# Altium schematic sheet Main.SchDoc: Main
size Tabloid; Author: Parker Brown
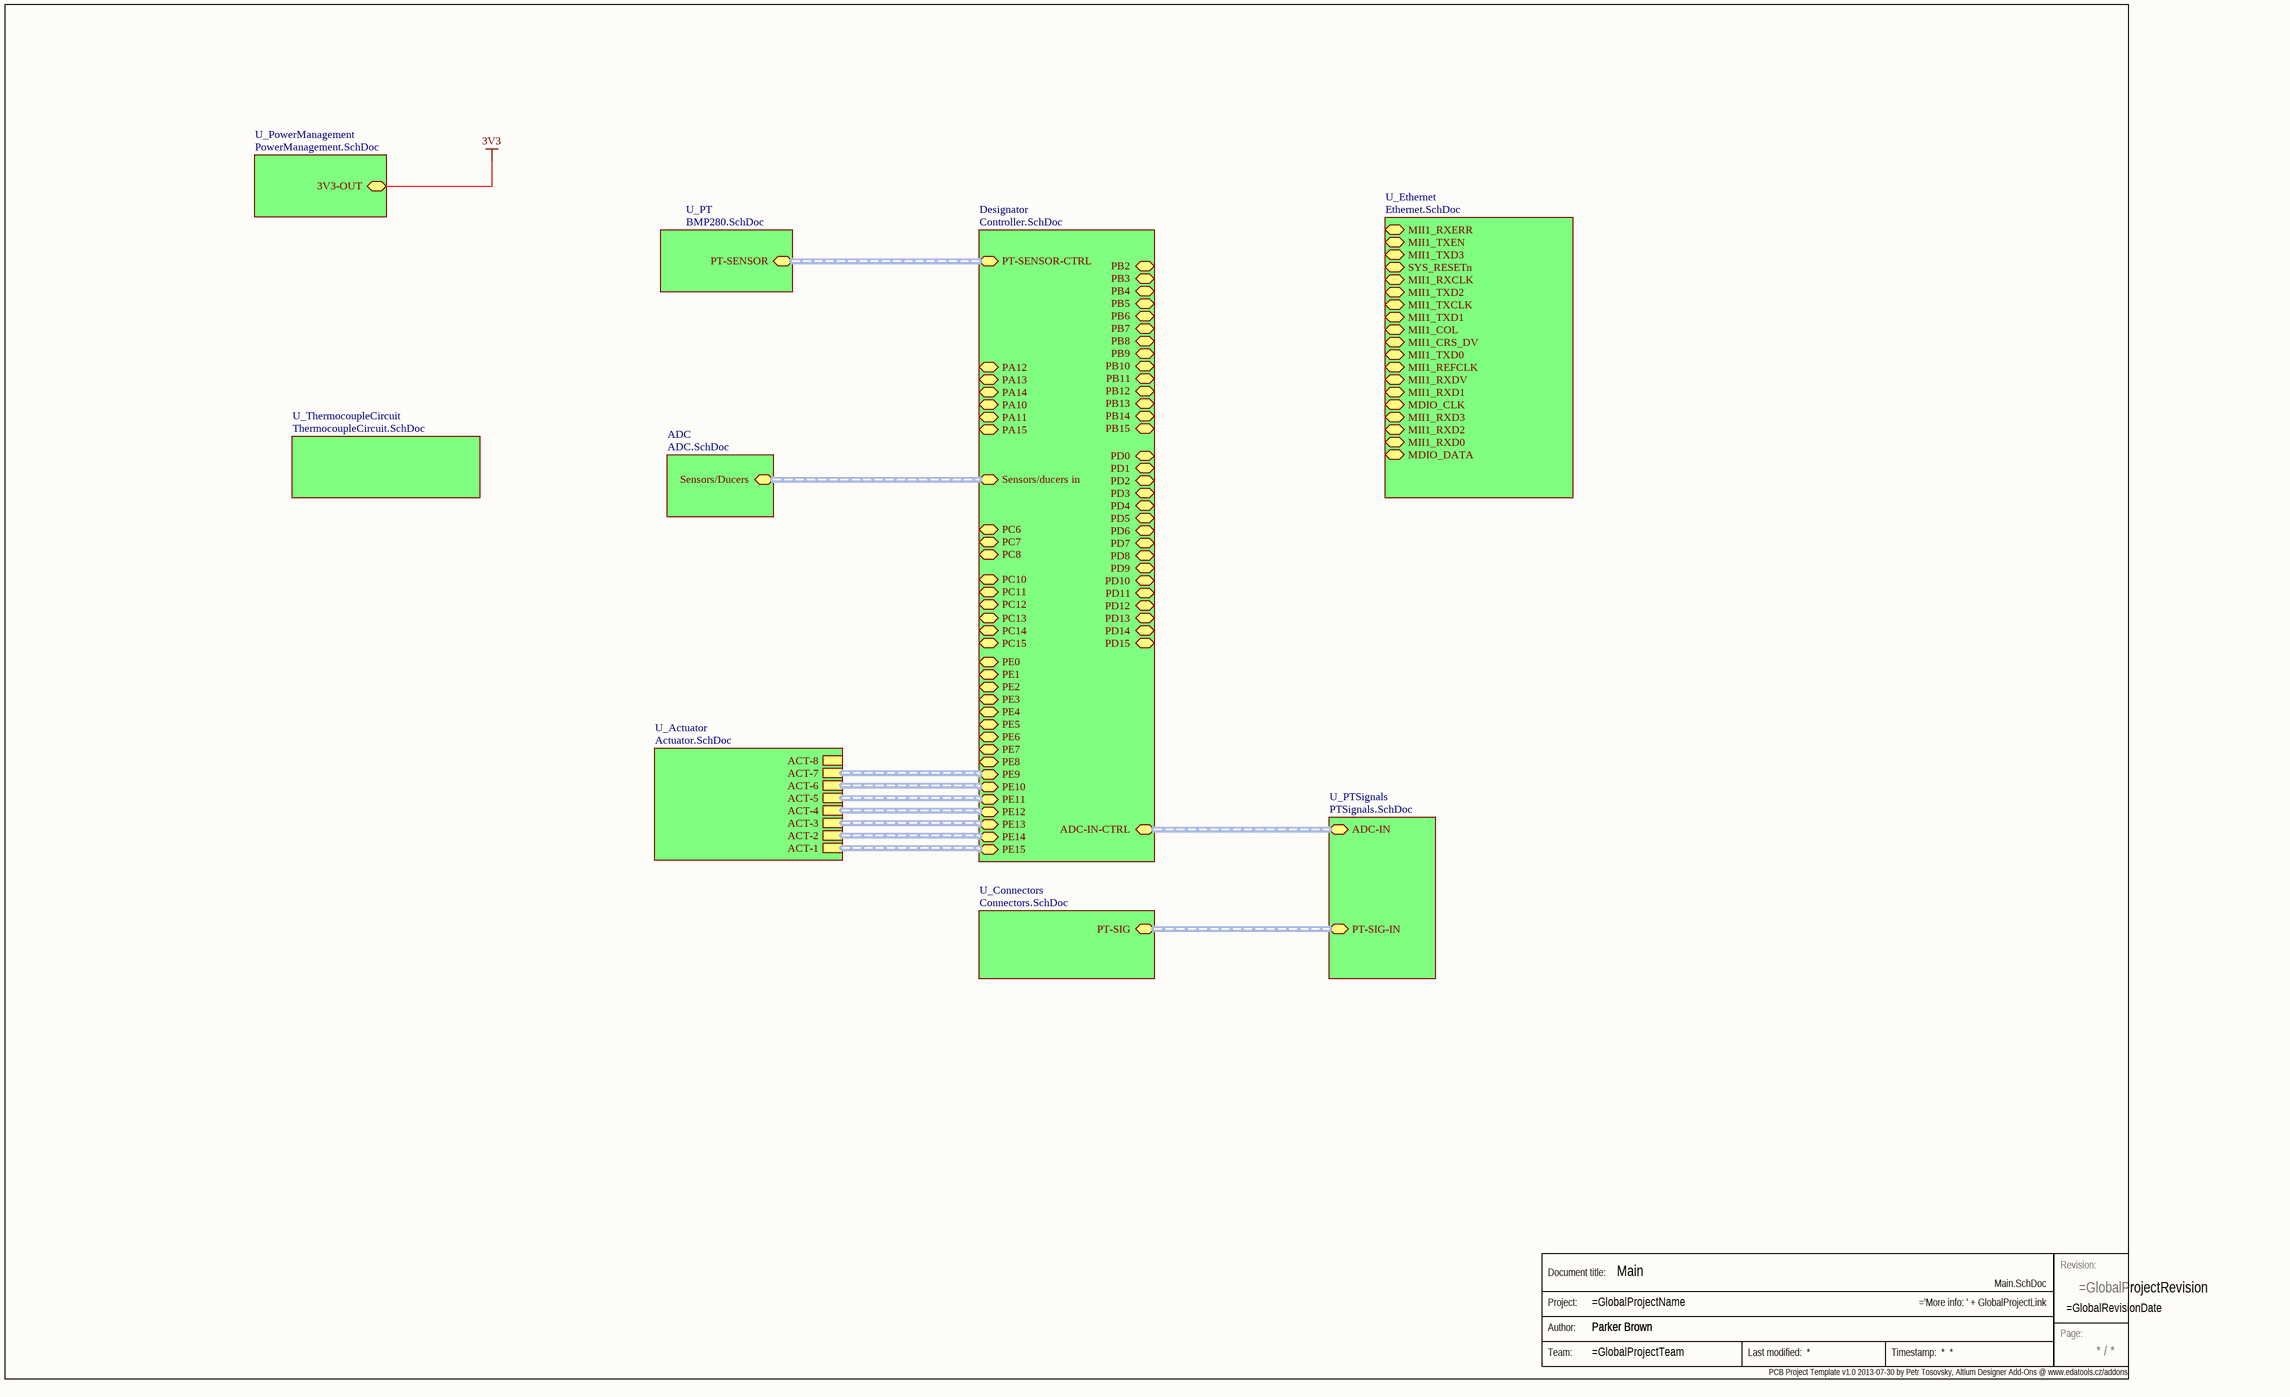
[diagram p0: Main.SchDoc]

## Parts
Stamp  Stamp  (value not drawn)  (graphical)

## Sub-sheets
ADC = ADC.SchDoc: Sensors/Ducers (harness ADC to micro)
Designator = Controller.SchDoc: PA12, PA13, PA14, PA10, PA11, PA15, PC6, PC7, PC8, PC13, PC14, PC15, PC11, PC12, PC10, PE0, PE1, PE2, PE3, PE4, PE5, PE6, PE7, PE8, PE9, PE10, PE11, PE12, PE13, PE14, PE15, PB2, PB3, PB4, PB5, PB6, PB7, PB8, PB9, PB10, PB11, PB12, PB13, PB14, PB15, PD0, PD1, PD2, PD3, PD4, PD5, PD6, PD7, PD8, PD9, PD10, PD11, PD12, PD13, PD14, PD15, ADC-IN-CTRL (harness ADC), PT-SENSOR-CTRL (harness PT-SENSOR), Sensors/ducers in (harness ADC)
U_Actuator = Actuator.SchDoc: ACT-8 (harness ACT), ACT-7 (harness ACT), ACT-6 (harness ACT), ACT-5 (harness ACT), ACT-4 (harness ACT), ACT-3 (harness ACT), ACT-2 (harness ACT), ACT-1 (harness ACT)
U_Connectors = Connectors.SchDoc: PT-SIG (harness PT-SIGNALS)
U_Ethernet = Ethernet.SchDoc: MII1_RXERR, MII1_TXEN, MII1_TXD3, SYS_RESETn, MII1_RXCLK, MII1_TXD2, MII1_TXCLK, MII1_TXD1, MII1_COL, MII1_CRS_DV, MII1_TXD0, MII1_REFCLK, MII1_RXDV, MII1_RXD1, MDIO_CLK, MII1_RXD3, MII1_RXD2, MII1_RXD0, MDIO_DATA
U_PowerManagement = PowerManagement.SchDoc: 3V3-OUT
U_PT = BMP280.SchDoc: PT-SENSOR (harness PT-SENSOR)
U_PTSignals = PTSignals.SchDoc: PT-SIG-IN (harness PT-SIGNALS), ADC-IN (harness ADC)
U_ThermocoupleCircuit = ThermocoupleCircuit.SchDoc: no entries

## Buses and harness runs
harness sheet ADC/Sensors/Ducers = sheet Designator/Sensors/ducers in
harness sheet Designator/ADC-IN-CTRL = sheet U_PTSignals/ADC-IN
harness sheet Designator/PE9 = sheet U_Actuator/ACT-7
harness sheet Designator/PE10 = sheet U_Actuator/ACT-6
harness sheet Designator/PE11 = sheet U_Actuator/ACT-5
harness sheet Designator/PE12 = sheet U_Actuator/ACT-4
harness sheet Designator/PE13 = sheet U_Actuator/ACT-3
harness sheet Designator/PE14 = sheet U_Actuator/ACT-2
harness sheet Designator/PE15 = sheet U_Actuator/ACT-1
harness sheet Designator/PT-SENSOR-CTRL = sheet U_PT/PT-SENSOR
harness sheet U_Connectors/PT-SIG = sheet U_PTSignals/PT-SIG-IN

## Notes on the sheet
- PCB Project Template v1.0 2013-07-30 by Petr Tosovsky, Altium Designer Add-Ons @ www.edatools.cz/addons <http://www.edatools.cz/addons>
- Labels drawn without touching a wire or pin: 3V3
- (in symbol Stamp) Revision:; Document title:; Project:; Author:; Page:; Team: